# Altium schematic sheet VoltageSensing.SchDoc
size A
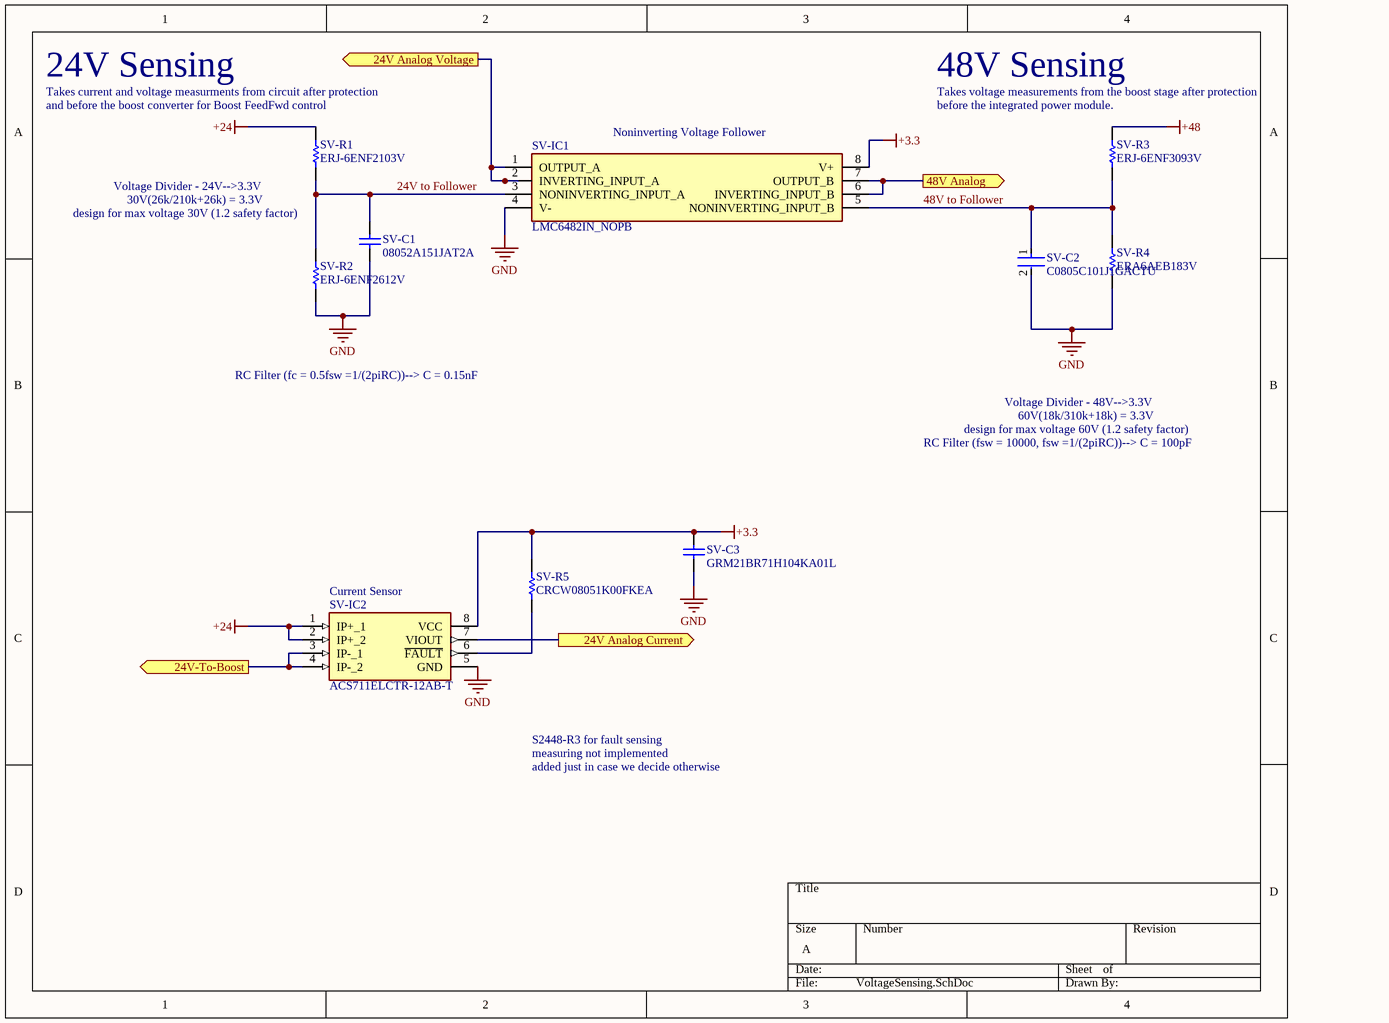
[diagram p0: VoltageSensing.SchDoc]

## Parts
SV-C1  08052A151JAT2A  [CAPC2013X140X50ML20T25]
SV-C2  C0805C101J1GACTU  [FP-C0805C-DN-MFG]
SV-C3  GRM21BR71H104KA01L  [CAPC2013X135X45ML10T25]
SV-IC1  LMC6482IN_NOPB  [DIP794W53P254L959H508Q8N]
SV-IC2  ACS711ELCTR-12AB-T  [SOIC127P600X175-8N]
SV-R1  ERJ-6ENF2103V  [RESC2013X70X40NL20T20]
SV-R2  ERJ-6ENF2612V  [RESC2013X70X40NL20T20]
SV-R3  ERJ-6ENF3093V  [RESC2013X70X40NL20T20]
SV-R4  ERA6AEB183V  [RESC2013X60X40LL20T25]
SV-R5  CRCW08051K00FKEA  [RESC2013X50X30NL20T20]

## Ports
24V Analog Current (out), 24V Analog Voltage (out), 24V-To-Boost (out), 48V Analog (out)

## Nets
+3.3: SV-C3.2 SV-IC1.8(V+) SV-IC2.8(VCC) SV-R5.2
+24: SV-IC2.1(IP+_1) SV-IC2.2(IP+_2) SV-R1.2
+48: SV-R3.2
GND: SV-C1.1 SV-C2.2 SV-C3.1 SV-IC1.4(V-) SV-IC2.5(GND) SV-R2.1 SV-R4.1
24V Analog Current: SV-IC2.7(VIOUT) ; port 24V Analog Current
24V Analog Voltage: SV-IC1.1(OUTPUT_A) SV-IC1.2(INVERTING_INPUT_A) ; port 24V Analog Voltage
24V to Follower: SV-C1.2 SV-IC1.3(NONINVERTING_INPUT_A) SV-R1.1 SV-R2.2
24V-To-Boost: SV-IC2.3(IP-_1) SV-IC2.4(IP-_2) ; port 24V-To-Boost
48V Analog: SV-IC1.6(INVERTING_INPUT_B) SV-IC1.7(OUTPUT_B) ; port 48V Analog
48V to Follower: SV-C2.1 SV-IC1.5(NONINVERTING_INPUT_B) SV-R3.1 SV-R4.2
NetSV-IC2_6: SV-IC2.6(~{FAULT}) SV-R5.1

## Notes on the sheet
- 24V Sensing
- (near SV-R1) Takes current and voltage measurments from circuit after protection
- 48V Sensing
- (near SV-R3) Takes voltage measurements from the boost stage after protection
- (near SV-R1) and before the boost converter for Boost FeedFwd control
- (near SV-IC1) Noninverting Voltage Follower
- (near SV-R3) before the integrated power module.
- (near SV-C1) design for max voltage 30V (1.2 safety factor)
- (near SV-R1) Voltage Divider - 24V-->3.3V
- 30V(26k/210k+26k) = 3.3V
- RC Filter (fc = 0.5fsw =1/(2piRC))--> C = 0.15nF
- design for max voltage 60V (1.2 safety factor)
- Voltage Divider - 48V-->3.3V
- 60V(18k/310k+18k) = 3.3V
- RC Filter (fsw = 10000, fsw =1/(2piRC))--> C = 100pF
- (near SV-IC2) Current Sensor
- S2448-R3 for fault sensing
- measuring not implemented
- added just in case we decide otherwise

## Library data of the parts
SV-C1 = CMP-2007-04584-1: Manufacturer: AVX Interconnect / Elco; Part Number: 08052A151JAT2A
SV-C2 = CMP-03020-014281-1: CAP CER 100PF 100V C0G/NP0 0805; Manufacturer: KEMET; Temperature Coefficient: 30ppm/°C; Temperature Characteristic: C0G; Tolerance: 0.05; RoHS: TRUE; ComponentLink2URL: https://content.kemet.com/datasheets/KEM_C1003_C0G_SMD.pdf; Voltage Rating: 100 V; Height: 0.88mm; Capacitance: 100 pF; Device Class L3: Ceramic Capacitors; Temperature: -55°C to +125°C; Manufacturer Part Number: C0805C101J1GACTU; Digikey Description: CAP CER 100PF 100V C0G/NP0 0805; Device Class L1: Passive Components; Lead Free: Yes; Package: C0805C-DN; Octopart: https://octopart.com/c0805c101j1gactu-kemet-123666; Automotive: No; Category: Cap; Temperature Range High: +125°C; Mouser Description: Multilayer Ceramic Capacitors MLCC - SMD/SMT 100volts 100pF C0G 5%; Temperature Range Low: -55°C; ComponentLink2Description: Datasheet; Ipc Land Pattern Name: CAPC200125X78; Material: Ceramic; Device Class L2: Capacitors; Value: 100 pF
SV-C3 = CMP-2100-03644-1: Chip Capacitor, 0.1 uF, +/- 10%, 50 V, -55 to 125 degC, 0805 (2012 Metric), RoHS, Tape and Reel; Manufacturer: Murata; Voltage: 50V; Capacitance: 100nF; Insulation Resistance: 10GR; Dielectric Material: Ceramic; Dielectric: X7R; Package Description: 2-Pin Surface Mount Device, Body 2 x 1.25 mm; Manufacturer URL: http://www.murata.com/; Case Code (Imperial): 0805; Datasheet URL: http://psearch.en.murata.com/capacitor/product/GRM21BR71H104KA01%23.pdf; Termination: SMD/SMT; Lead Free: LeadFree; Package Quantity: 1; Mount: SurfaceMount; REACH SVHC: Unknown; Thickness: 0.053inch; Height: 1.25mm; Case/Package: 0805; Voltage Rating: 50V; Width: 0.049inch; Case Code (Metric): 2012; Material: Ceramic; Min Operating Temperature: -55degC; RoHSCompliant: true; Datasheet Version: 42675.0; Voltage Rating (DC): 50V; Tolerance: 10%; Package Reference: 0805; Depth: 1.25mm; Length: 2mm; Max Operating Temperature: 125degC; Packaging: TapeandReel; Number of Pins: 2; Radiation Hardening: No
SV-IC1 = LMC6482IN_NOPB: Integrated Circuit; Manufacturer_Name: Texas Instruments; Manufacturer_Part_Number: LMC6482IN/NOPB; Datasheet Link: http://www.ti.com/lit/gpn/lmc6482; Height: 5.08mm; Mouser Part Number: 926-LMC6482IN/NOPB; Mouser Price/Stock: https://www.mouser.co.uk/ProductDetail/Texas-Instruments/LMC6482IN-NOPB?qs=QbsRYf82W3EByDDrj8Vijg%3D%3D; Arrow Part Number: LMC6482IN/NOPB; Arrow Price/Stock: https://www.arrow.com/en/products/lmc6482innopb/texas-instruments
SV-IC2 = ACS711ELCTR-12AB-T: Integrated Circuit; Manufacturer_Name: Allegro Microsystems; Datasheet Link: https://www.allegromicro.com/~/media/Files/Datasheets/ACS711-Datasheet.ashx; Height: 1.75mm; Manufacturer_Part_Number: ACS711ELCTR-12AB-T; Arrow Part Number: ACS711ELCTR-12AB-T; Arrow Price/Stock: https://www.arrow.com/en/products/acs711elctr-12ab-t/allegro-microsystems
SV-R1 = CMP-2001-00038-1: Manufacturer: Panasonic; Part Number: ERJ-6ENF2103V
SV-R2 = CMP-1013-00668-2: Manufacturer: Panasonic; Part Number: ERJ-6ENF2612V
SV-R3 = CMP-2001-00119-1: Manufacturer: Panasonic; Part Number: ERJ-6ENF3093V
SV-R4 = CMP-2001-00606-1: Manufacturer: Panasonic; Part Number: ERA6AEB183V
SV-R5 = CMP-1013-00510-2: Manufacturer: Vishay Dale; Part Number: CRCW08051K00FKEA